# Altium schematic sheet 01_Main.SchDoc
size A3
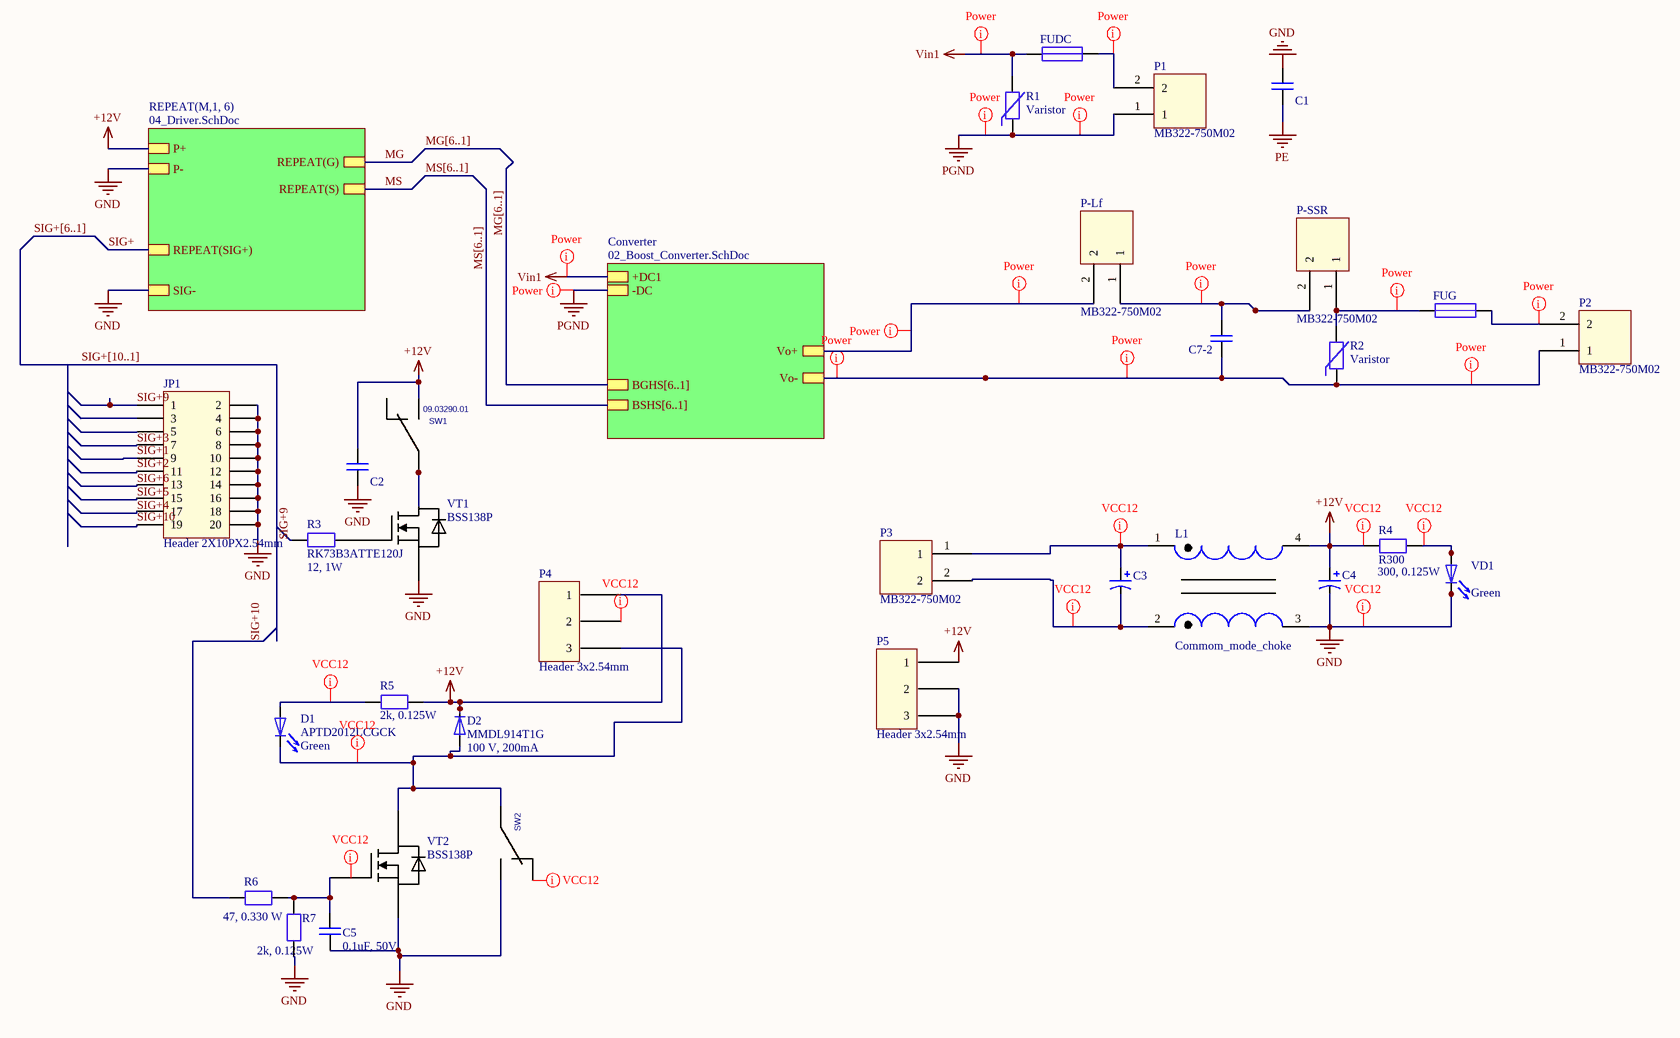
[diagram p0: 01_Main.SchDoc]

## Parts
C1  Cer_large  [CAPC3227X25N]  (value not drawn)
C2  Cer_large  [CAPC3227X25N]  (value not drawn)
C3  NACEW102M25V12.5X14  [Cap_pol]  (value not drawn)
C4  NACEW102M25V12.5X14  [Cap_pol]  (value not drawn)
C5  0.1uF, 50V  [C_0805]
C7-2  C_ceram_HV  [C_ceram_HV]  (value not drawn)
D1  APTD2012LCGCK  value Green  [LED_SMD_0805]
D2  MMDL914T1G  value 100 V, 200mA  [SOD323F]
FUDC  Fuse 1  [Fuse5x20mm]  (value not drawn)
FUG  Fuse 1  [Fuse5x20mm]  (value not drawn)
JP1  Header 2X10PX2.54mm  [Header 2X10PX2.54mm]
L1  Commom_mode_choke  [Common_mode]
P1  MB322-750M02  [2_HOLES_7.5]
P2  MB322-750M02  [2_HOLES_7.5]
P3  MB322-750M02  [2_HOLES_7.5]
P4  Header 3x2.54mm  [3_HOLES]
P5  Header 3x2.54mm  [3_HOLES]
P-Lf  MB322-750M02  [2_HOLES_7.5]
P-SSR  MB322-750M02  [2_HOLES_7.5]
R1  Varistor  [Axial 0.2]
R2  Varistor  [Axial 0.2]
R3  RK73B3ATTE120J  value 12, 1W  [SMD_2512]
R4  R300  value 300, 0.125W  [SMD_2010]
R5  value 2k, 0.125W  [SMD_0805]  (hidden comment: 2k, 0.125W, 1%)
R6  47, 0.330 W  [SMD_0805]
R7  value 2k, 0.125W  [SMD_0805]  (hidden comment: 2k, 0.125W, 1%)
SW1  09.03290.01  [3_HOLES]
SW2  SWITCH3  [3_HOLES]  (value not drawn)
VD1  value Green  [LED_SMD_0805]  (hidden comment: APTD2012LCGCK)
VT1  BSS138P  [SOT65P210X110-3N]
VT2  BSS138P  [SOT65P210X110-3N]

## Sub-sheets
Converter = 02_Boost_Converter.SchDoc: +DC1, -DC, Vo+, Vo-, BSHS[6..1], BGHS[6..1]
REPEAT(M,1, 6) = 04_Driver.SchDoc: REPEAT(G), REPEAT(S), SIG-, REPEAT(SIG+), P-, P+

## Nets
+12V: C2.1 C4.1 D2.2 L1.4 P4.1 P5.1 R4.1 R5.1 SW1.3 ; sheet REPEAT(M,1, 6)/P+
GND: C1.1 C2.2 C4.2 C5.2 JP1.2 JP1.4 JP1.6 JP1.8 JP1.10 JP1.12 JP1.14 JP1.16 JP1.18 JP1.20 L1.3 P5.2 P5.3 R7.1 SW2.3 VD1.2 VT1.3(S) VT2.3(S) ; sheet REPEAT(M,1, 6)/SIG-, sheet REPEAT(M,1, 6)/P-
PE: C1.2
PGND: P1.1 R1.1 ; sheet Converter/-DC
Vin1: FUDC.1 R1.2 ; sheet Converter/+DC1
MG: sheet REPEAT(M,1, 6)/REPEAT(G)
MS: sheet REPEAT(M,1, 6)/REPEAT(S)
SIG+: sheet REPEAT(M,1, 6)/REPEAT(SIG+)
SIG+1: JP1.9
SIG+2: JP1.11
SIG+3: JP1.7
SIG+4: JP1.17
SIG+5: JP1.15
SIG+6: JP1.13
SIG+9: JP1.1 R3.1
SIG+10: JP1.19 R6.1
NetC3_1: C3.1 L1.1 P3.1
NetC3_2: C3.2 L1.2 P3.2
NetC5_1: C5.1 R6.2 R7.2 VT2.1(G)
NetC7-2_1: C7-2.1 P-Lf.1 P-SSR.2
NetC7-2_2: C7-2.2 P2.1 R2.1 ; sheet Converter/Vo-
NetD1_1: D1.1 R5.2
NetD1_2: D1.2 D2.1 P4.3 SW2.2 VT2.2(D)
NetFUDC_2: FUDC.2 P1.2
NetFUG_1: FUG.1 P-SSR.1 R2.2
NetFUG_2: FUG.2 P2.2
NetP-Lf_2: P-Lf.2 ; sheet Converter/Vo+
NetR3_2: R3.2 VT1.1(G)
NetR4_2: R4.2 VD1.1
NetSW1_1: SW1.1 VT1.2(D)

Not connected (* = marked no-connect by the designer): JP1 3 5; P4 2; SW1 2; SW2 1

## Buses and harness runs
bus MG[6..1]
bus MG[6..1] = sheet Converter/BGHS[6..1]
bus MS[6..1]
bus MS[6..1] = sheet Converter/BSHS[6..1]
bus SIG+[6..1]
bus SIG+[10..1]

## Layout directives
net class +12: (no net found under the mark), +12V, GND, NetC3_1, NetC3_2, NetD1_1, NetD1_2, NetP4_2, NetR4_2, NetSW2_1
net class Power: NetC7-2_1, NetC7-2_2, NetFUDC_2, NetFUG_1, NetFUG_2, NetP-Lf_2, PGND, Vin1

## Library data of the parts
C1 C2 = Cer_large: Order code: 1759466; Value: 22mkF; Type: 16V; Supplier: Farnel; Price: 0.407; Package: 1210
C3 C4 = NACEW102M25V12.5X14: Value: 1 mF; Type: 25V; Order code: 16731346; Supplier: Elfa; Price: 3,28
C5 = Cap_UMF212B7104KGHT: 0.1uF, 50V, MLCC; Manufacturer: Taiyo Yuden; Order code: 963-UMF212B7104KGHT; Supplier: Mouser; Price: 0,198; Type: MLCC; Package: smd 0805; PartNumber: UMF212B7104KGHT; value: 0.1uF, 50V
D1 VD1 = LED_APTD2012LCGCK: Green LED, 0805; Manufacturer: Kingbright; order code: 604-APTD2012LCGCK; Type: Standard LEDs - SMD; Price: 0,378; Supplier: Mouser; PartNumber: APTD2012LCGCK; Package: smd 0805
D2 = Diode_MMDL914T1G: 100 V, 200mA, Diodes; Manufacturer: ON Semiconductor; Order code: 863-MMDL914T1G; Type: Diodes; Supplier: Mouser; Package: SOD-323; Price: 0,099; PartNumber: MMDL914T1G
FUDC FUG = Fuse 1: Manufacturer: Schurter; Value: Fuse 5x20; Order code: 33-173-75, 33-160-31, 33-161-63; Type: 16A; Price: 0,48; 0,54; 0,45; Supplier: Elfa; Package: Fuse 5x20
JP1 = Header 2X10PX2.54mm: 2x10x2.54mm, Shrouded; Manufacturer: Amphenol FCI; PartNumber: 52601-S20-6LF; Order code: 649-52601-S20-6LF; Package: 2x10x2.54mm; Price: 1,68; Publisher: *; Supplier: Mouser; Type: Shrouded; Value: 2x10x2.54mm; Header 2X10PX2.54mm: *
L1 = Commom_mode_choke: Manufacturer: Wьrth Elektronik; Type: Common mode choke; Value: 20 mH 0.5 A; Order code: 15857854; Supplier: Elfa; Package: Trough_hole; Price: 4,54
P1-P3 P-Lf P-SSR = MB322-750M02: Value: 2 poles, 16A, 750V; Order code: 48-397-07; Type: MB322-750M02; Manufacturer: *; Supplier: Elfa; Package: 7.5 mm; Price: 0.43
P4 P5 = Header_3-Pin_281695-3: 3x2.54mm, Headers & Wire Housings; Manufacturer: TE Connectivity / AMP; Order code: 571-281695-3; Type: Headers & Wire Housings; Value: 3x2.54mm; Package: 3x2.54mm; Supplier: Mouser; Price: 0,52; PartNumber: 281695-3
R1 R2 = Varistor: Manufacturer: EPCOS; Value: 615V; Order code: 60-307-55; Type: Res Var; Supplier: Elfa; Price: 0,38; Package: 48X8X6 mm
R3 = RK73B3ATTE120J: Manufacturer: KOA; Order code: 60-205-98; Type: 200V, 5%; Supplier: Elfa; Price: 0,144; Package: smd 2512
R5 R7 = Res_CRCW08052K00FKEAC: 2k, 0.125W, 1%, 0805, Thick Film Resistors; Manufacturer: Vishay; Order code: 71-CRCW08052K00FKEAC; Price: 0,097; Supplier: Mouser; datasheet: https://www1.elfa.se/data1/wwwroot/assets/datasheets/06016752.pdf; Type: Thick Film Resistors; Package: smd 0805; PartNumber: CRCW08052K00FKEAC
R6 = RK73H2ATTD47R0F: 47, 0.330 W, 0805, Thick Film Resistors; Manufacturer: TE Connectivity / Holsworthy; Order code: 279-CRGH0805F47R; Price: 0,09; Supplier: Mouser; datasheet: https://www1.elfa.se/data1/wwwroot/assets/datasheets/06016752.pdf; Type: Thick Film Resistors - SMD; Package: smd 0805; PartNumber: RK73H2ATTD47R0F; Value: 47, 0.330 W
SW1 = SW_09.03290.01: 12 VDC, Slide Switches; Manufacturer: EAO; Value: 12 VDC; Order code: 123-09.03290.01; datasheet: https://www1.elfa.se/data1/wwwroot/assets/datasheets/03536521.pdf; Price: 1,43; Supplier: Mouser; Package: 3x2,54; Type: Slide Switches; PartNumber: 09.03290.01
SW2 = SWITCH3: Manufacture: EAO; Order code: 3536547; Value: *; datasheet: https://www1.elfa.se/data1/wwwroot/assets/datasheets/03536521.pdf; Price: 1,59; Supplier: Elfa; Package: 3x2,54; Publisher: *; Type: Jumper
VT1 VT2 = BSS138P: Manufacturer: Nexperia; Type: APT77N60SC6; Value: 60V, 1Ohm; Package: SOT23; Publisher: *; Supplier: mouser
R4 = R300: Type: 16V, 1%; Package: smd 2010; Price: *; Supplier: *; Order code: *; Manufacturer: *